# Altium schematic sheet 01_USB_Interface.SchDoc: Mainboard USB
size A3; SheetNumber: 1; SheetTotal: 3
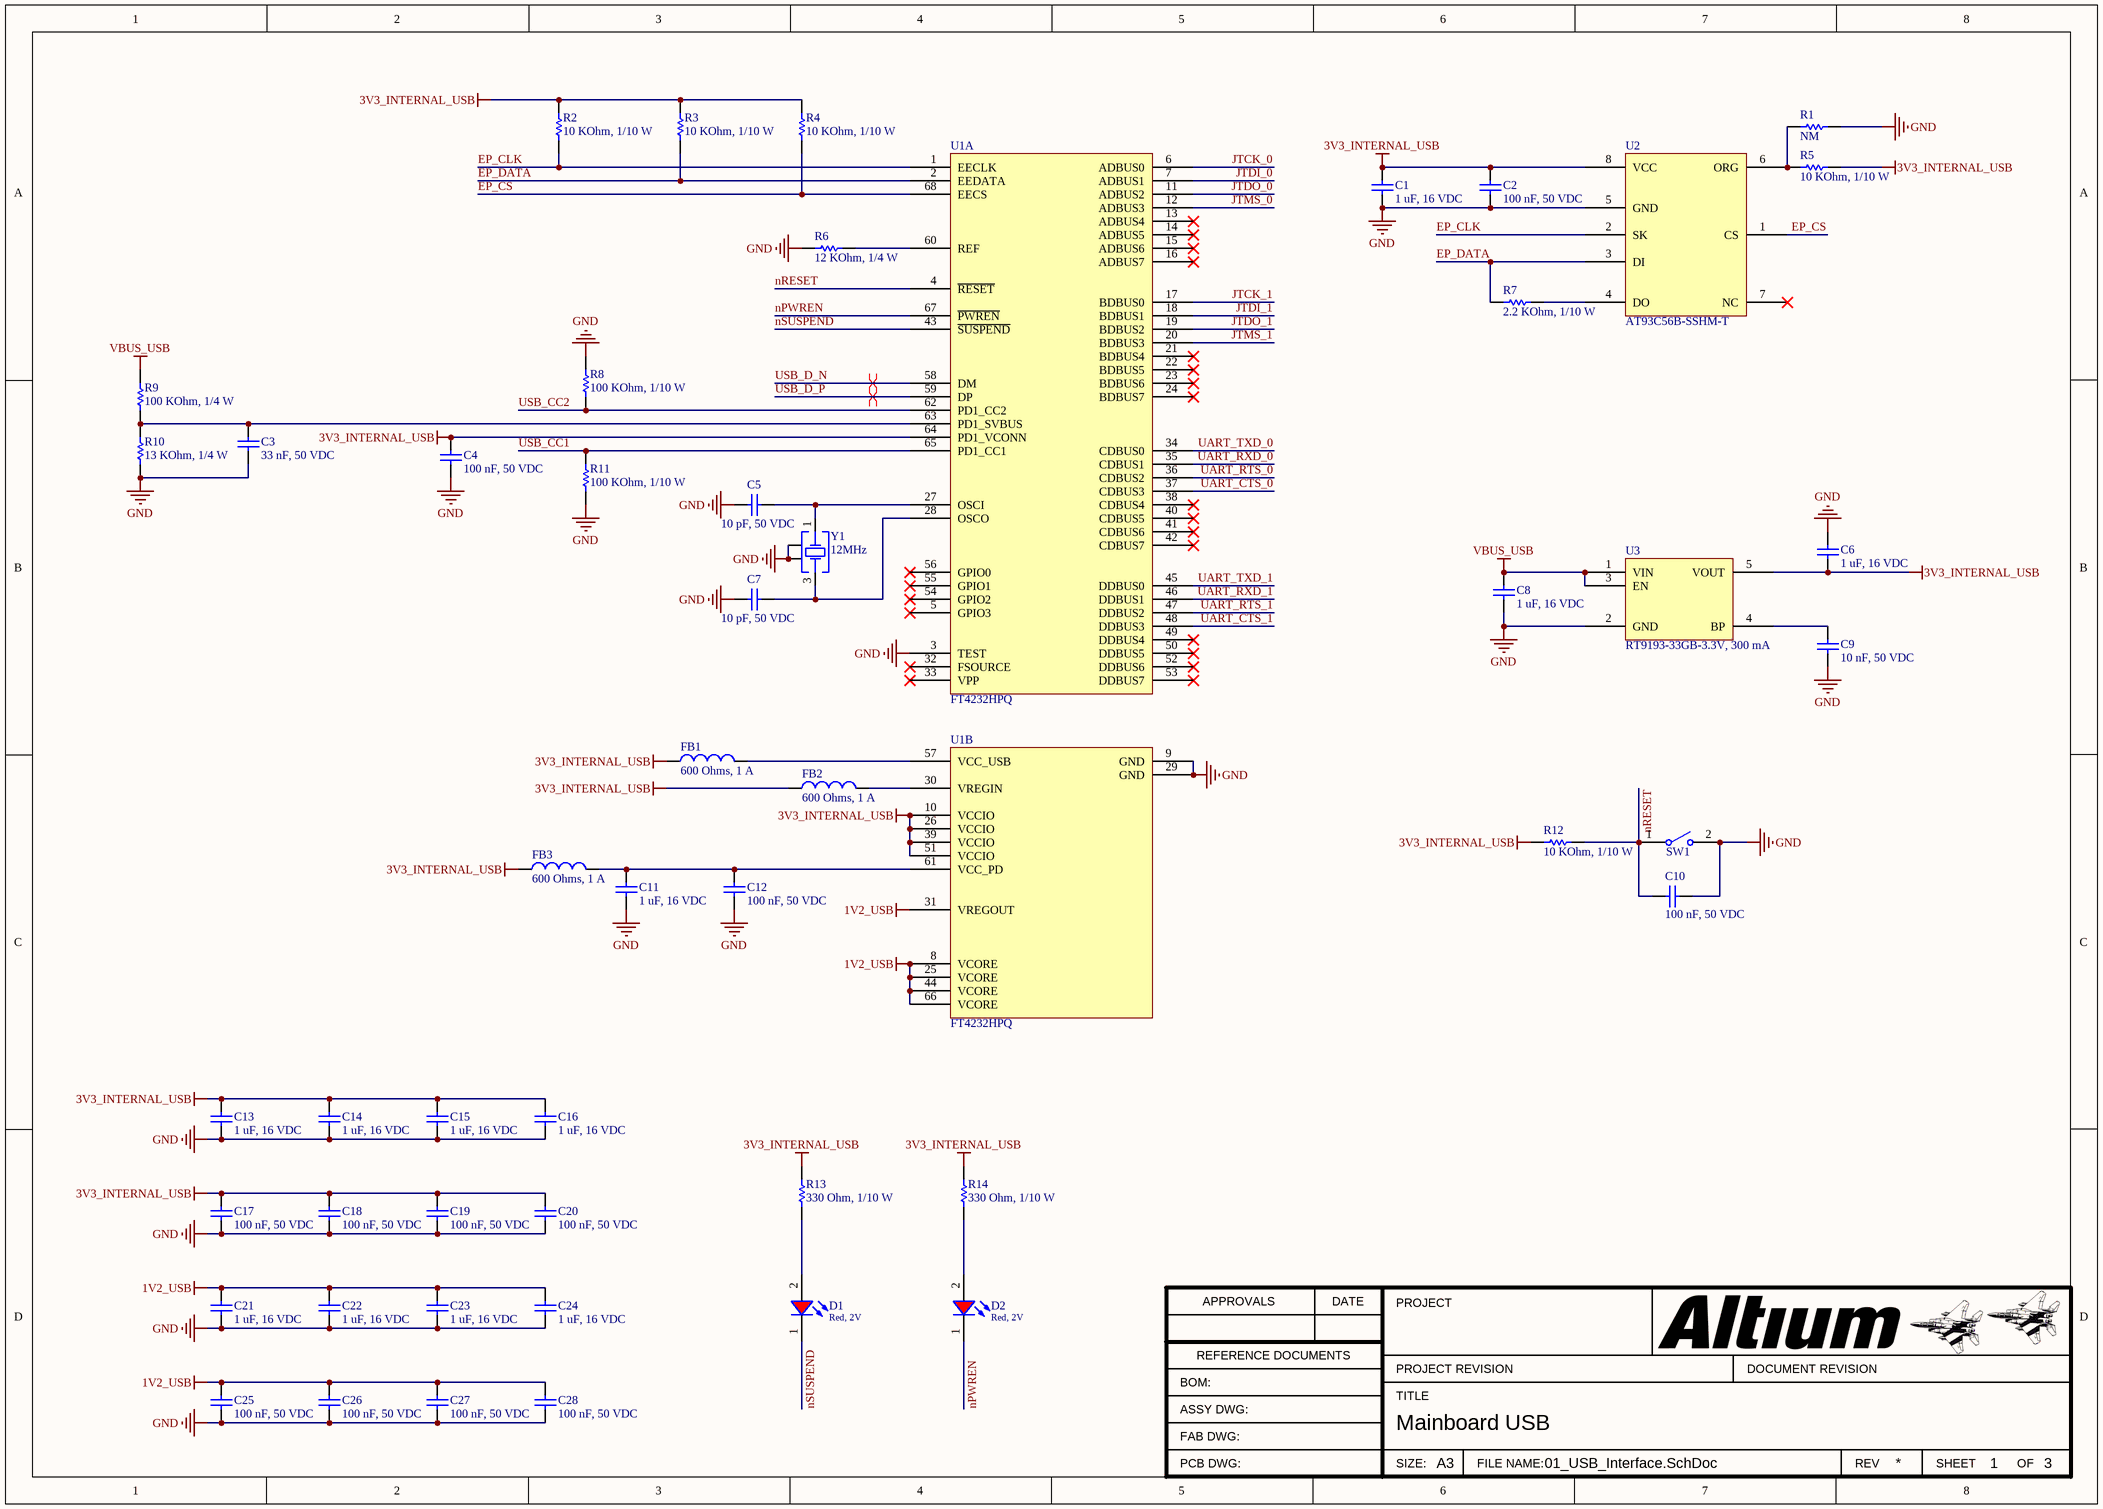
[diagram p0: 01_USB_Interface.SchDoc]

## Parts
C1  1 uF, 16 VDC  [CAP_0603]
C2  100 nF, 50 VDC  [CAP_0603]
C3  33 nF, 50 VDC  [CAP_0603]
C4  100 nF, 50 VDC  [CAP_0603]
C5  10 pF, 50 VDC  [CAP_0603]
C6  1 uF, 16 VDC  [CAP_0603]
C7  10 pF, 50 VDC  [CAP_0603]
C8  1 uF, 16 VDC  [CAP_0603]
C9  10 nF, 50 VDC  [CAP_0603]
C10  100 nF, 50 VDC  [CAP_0603]
C11  1 uF, 16 VDC  [CAP_0603]
C12  100 nF, 50 VDC  [CAP_0603]
C13  1 uF, 16 VDC  [CAP_0603]
C14  1 uF, 16 VDC  [CAP_0603]
C15  1 uF, 16 VDC  [CAP_0603]
C16  1 uF, 16 VDC  [CAP_0603]
C17  100 nF, 50 VDC  [CAP_0603]
C18  100 nF, 50 VDC  [CAP_0603]
C19  100 nF, 50 VDC  [CAP_0603]
C20  100 nF, 50 VDC  [CAP_0603]
C21  1 uF, 16 VDC  [CAP_0603]
C22  1 uF, 16 VDC  [CAP_0603]
C23  1 uF, 16 VDC  [CAP_0603]
C24  1 uF, 16 VDC  [CAP_0603]
C25  100 nF, 50 VDC  [CAP_0603]
C26  100 nF, 50 VDC  [CAP_0603]
C27  100 nF, 50 VDC  [CAP_0603]
C28  100 nF, 50 VDC  [CAP_0603]
D1  Red, 2V  [WL-SMCW_0603_H=0.7mm]
D2  Red, 2V  [WL-SMCW_0603_H=0.7mm]
FB1  600 Ohms, 1 A  [FER_0603]
FB2  600 Ohms, 1 A  [FER_0603]
FB3  600 Ohms, 1 A  [FER_0603]
R1  NM  [RES_0603]
R2  10 KOhm, 1/10 W  [RES_0603]
R3  10 KOhm, 1/10 W  [RES_0603]
R4  10 KOhm, 1/10 W  [RES_0603]
R5  10 KOhm, 1/10 W  [RES_0603]
R6  12 KOhm, 1/4 W  [RES_0603]
R7  2.2 KOhm, 1/10 W  [RES_0603]
R8  100 KOhm, 1/10 W  [RES_0603]
R9  100 KOhm, 1/4 W  [RES_0603]
R10  13 KOhm, 1/4 W  [RES_0603]
R11  100 KOhm, 1/10 W  [RES_0603]
R12  10 KOhm, 1/10 W  [RES_0603]
R13  330 Ohm, 1/10 W  [RES_0603]
R14  330 Ohm, 1/10 W  [RES_0603]
SW1  TS-1101-C-W  [TS-1101-C-W]  (value not drawn)
U1  FT4232HPQ  [FT4232HPQ]  (parts A,B of 2)
U2  AT93C56B-SSHM-T  [AT93C56B]
U3  RT9193-33GB-3.3V, 300 mA  [RT9193-xxGB]
Y1  12MHz  [WE-XTAL_CFPX-180]

## Nets
1V2_USB: C21.2 C22.2 C23.2 C24.2 C25.2 C26.2 C27.2 C28.2 U1.8(VCORE) U1.25(VCORE) U1.31(VREGOUT) U1.44(VCORE) U1.66(VCORE)
3V3_INTERNAL_USB: C1.2 C2.2 C4.2 C6.2 C13.2 C14.2 C15.2 C16.2 C17.2 C18.2 C19.2 C20.2 FB1.1 FB2.1 FB3.1 R2.2 R3.2 R4.2 R5.2 R12.2 R13.2 R14.2 U1.10(VCCIO) U1.26(VCCIO) U1.39(VCCIO) U1.51(VCCIO) U1.64(PD1_VCONN) U2.8(VCC) U3.5(VOUT)
GND: C1.1 C2.1 C3.1 C4.1 C5.1 C6.1 C7.1 C8.1 C9.1 C10.1 C11.1 C12.1 C13.1 C14.1 C15.1 C16.1 C17.1 C18.1 C19.1 C20.1 C21.1 C22.1 C23.1 C24.1 C25.1 C26.1 C27.1 C28.1 R1.1 R6.1 R8.1 R10.1 R11.1 SW1.2 U1.3(TEST) U1.9(GND) U1.29(GND) U2.5(GND) U3.2(GND) Y1.2(GND) Y1.4(GND)
VBUS_USB: C8.2 R9.2 U3.1(VIN) U3.3(EN)
EP_CLK: R2.1 U1.1(EECLK) U2.2(SK)
EP_CS: R4.1 U1.68(EECS) U2.1(CS)
EP_DATA: R3.1 R7.1 U1.2(EEDATA) U2.3(DI)
JTCK_0: U1.6(ADBUS0)
JTCK_1: U1.17(BDBUS0)
JTDI_0: U1.7(ADBUS1)
JTDI_1: U1.18(BDBUS1)
JTDO_0: U1.11(ADBUS2)
JTDO_1: U1.19(BDBUS2)
JTMS_0: U1.12(ADBUS3)
JTMS_1: U1.20(BDBUS3)
nPWREN: D2.1(K) U1.67(~{PWREN})
nRESET: C10.2 R12.1 SW1.1 U1.4(~{RESET})
nSUSPEND: D1.1(K) U1.43(~{SUSPEND})
UART_CTS_0: U1.37(CDBUS3)
UART_CTS_1: U1.48(DDBUS3)
UART_RTS_0: U1.36(CDBUS2)
UART_RTS_1: U1.47(DDBUS2)
UART_RXD_0: U1.35(CDBUS1)
UART_RXD_1: U1.46(DDBUS1)
UART_TXD_0: U1.34(CDBUS0)
UART_TXD_1: U1.45(DDBUS0)
USB_CC1: R11.2 U1.65(PD1_CC1)
USB_CC2: R8.2 U1.62(PD1_CC2)
USB_D_N: U1.58(DM)
USB_D_P: U1.59(DP)
NetC3_2: C3.2 R9.1 R10.2 U1.63(PD1_SVBUS)
NetC5_2: C5.2 U1.27(OSCI) Y1.1(Crystal)
NetC7_2: C7.2 U1.28(OSCO) Y1.3(Crystal)
NetC9_2: C9.2 U3.4(BP)
NetC11_2: C11.2 C12.2 FB3.2 U1.61(VCC_PD)
NetD1_2: D1.2(A) R13.1
NetD2_2: D2.2(A) R14.1
NetFB1_2: FB1.2 U1.57(VCC_USB)
NetFB2_2: FB2.2 U1.30(VREGIN)
NetR1_2: R1.2 R5.1 U2.6(ORG)
NetR6_2: R6.2 U1.60(REF)
NetR7_2: R7.2 U2.4(DO)

Not connected (* = marked no-connect by the designer): U1 5(GPIO3)* 13(ADBUS4)* 14(ADBUS5)* 15(ADBUS6)* 16(ADBUS7)* 21(BDBUS4)* 22(BDBUS5)* 23(BDBUS6)* 24(BDBUS7)* 32(FSOURCE)* 33(VPP)* 38(CDBUS4)* 40(CDBUS5)* 41(CDBUS6)* 42(CDBUS7)* 49(DDBUS4)* 50(DDBUS5)* 52(DDBUS6)* 53(DDBUS7)* 54(GPIO2)* 55(GPIO1)* 56(GPIO0)*; U2 7(NC)*

## Layout directives
differential pair: USB_D_N, USB_D_P

## Notes on the sheet
- APPROVALS
- DATE
- PROJECT
- BOM:
- REFERENCE DOCUMENTS
- TITLE
- PROJECT REVISION
- DOCUMENT REVISION
- ASSY DWG:
- FAB DWG:
- PCB DWG:
- SIZE:
- A3
- FILE NAME:
- REV
- SHEET
- OF

## Library data of the parts
C1 C6 C8 C11 C13-C16 C21-C24 = 0106031051016: CAP, size 0603, 1 uF, 16 VDC; Manufacturer: Samsung Electro-Mechanics; Manufacturer Part Number: CL10B105KO8NNWC; Capacitance: 1 uF; Tolerance: +/-10%; Voltage Rating DC: 16 VDC; Packaging: Tape and Reel; Supplier 1 URL: https://www.mouser.vn/ProductDetail/Samsung-Electro-Mechanics/CL10B105KO8NNWC?qs=81r%252BiQLm7BT%252BXtc72qn1ug%3D%3D&utm_source=mouser-refine-download&utm_medium=file&utm_campaign=CL10B105KO8NNWC&utm_content=Samsung-Electro-Mechanics; Supplier 2 URL: https://www.digikey.com/en/products/detail/samsung-electro-mechanics/cl10b105ko8nnwc/16572783; Supplier 3 URL: https://www.thegioiic.com/tu-gom-0603-1uf-16v; Value: 1 uF, 16 VDC; Supplier 1: Mouser; Supplier 1 Part Number: 187-CL10B105KO8NNWC; Supplier 2: Digi-Key; Supplier 2 Part Number: 1276-CL10B105KO8NNWCTR-ND; Supplier 3: thegioiic; Supplier 3 Part Number: N/A; ComponentLink1Description: Datasheet; ComponentLink1URL: https://www.mouser.vn/datasheet/2/585/Samsung_MLCC_1837944-1929650.pdf; Mount: SMD/SMT; Operating Temperature Max: + 85 C; Operating Temperature Min: - 40 C; Package / Case: 0603; LCSC Part #: C1592
C2 C4 C10 C12 C17-C20 C25-C28 = 0106031041050: CAP, size 0603, 100 nF, 50 VDC; Manufacturer: TDK; Manufacturer Part Number: CGA3E3X8R1H104K080AE; Capacitance: 100 nF; Tolerance: +/-10%; Voltage Rating DC: 50 VDC; Packaging: Tape and Reel; Supplier 1 URL: https://www.mouser.com/ProductDetail/TDK/CGA3E3X8R1H104K080AE?qs=nQSIdc08i%252Bd8g3IRRgU2bw%3D%3D&utm_source=mouser-refine-download&utm_medium=file&utm_campaign=CGA3E3X8R1H104K080AE&utm_content=TDK; Supplier 2 URL: https://www.digikey.com/en/products/detail/tdk-corporation/cga3e3x8r1h104k080ae/5809262; Supplier 3 URL: N/A; Value: 100 nF, 50 VDC; Supplier 1: Mouser; Supplier 1 Part Number: 810-CGA3E3X8R1H104KA; Supplier 2: Digi-Key; Supplier 2 Part Number: 445-173697-2-ND; Supplier 3: thegioiic; Supplier 3 Part Number: N/A; ComponentLink1Description: Datasheet; ComponentLink1URL: https://product.tdk.com/system/files/dam/doc/product/capacitor/ceramic/mlcc/catalog/mlcc_automotive_soft_en.pdf?ref_disty=mouser; Mount: SMD/SMT; Operating Temperature Max: + 85 C; Operating Temperature Min: - 40 C; Package / Case: 0603; LCSC Part #: C14663
C3 = 0106033331050: CAP, size 0603, 33 nF, 50 VDC; Manufacturer: TDK; Manufacturer Part Number: CGA3E2X7R1H333K080AA; Capacitance: 33 nF; Tolerance: +/-10%; Voltage Rating DC: 50 VDC; Packaging: Tape and Reel; Supplier 1 URL: https://www.mouser.com/ProductDetail/TDK/CGA3E2X7R1H333K080AA?qs=NRhsANhppD8XLu6u%252B%2FdPcg%3D%3D&utm_source=mouser-refine-download&utm_medium=file&utm_campaign=CGA3E2X7R1H333K080AA&utm_content=TDK; Supplier 2 URL: https://www.digikey.com/en/products/detail/tdk-corporation/cga3e2x7r1h333k080aa/2672817; Supplier 3 URL: N/A; Value: 33 nF, 50 VDC; Supplier 1: Mouser; Supplier 1 Part Number: 810-CGA3E2X7R1H333K; Supplier 2: Digi-Key; Supplier 2 Part Number: 445-6924-2-ND; Supplier 3: thegioiic; Supplier 3 Part Number: N/A; ComponentLink1Description: Datasheet; ComponentLink1URL: https://product.tdk.com/system/files/dam/doc/product/capacitor/ceramic/mlcc/catalog/mlcc_automotive_general_en.pdf?ref_disty=mouser; Mount: SMD/SMT; Operating Temperature Max: + 85 C; Operating Temperature Min: - 40 C; Package / Case: 0603; LCSC Part #: N/A
C5 C7 = 0106031000550: CAP, size 0603, 10 pF, 50 VDC; Manufacturer: TDK; Manufacturer Part Number: CGA3E2NP01H100D080AA; Capacitance: 10 pF; Tolerance: +/-5%; Voltage Rating DC: 50 VDC; Packaging: Tape and Reel; Supplier 1 URL: https://www.mouser.com/ProductDetail/TDK/CGA3E2NP01H100D080AA?qs=xLDY6iXSiQYSDBjUp7bVxg%3D%3D&utm_source=mouser-refine-download&utm_medium=file&utm_campaign=CGA3E2NP01H100D080AA&utm_content=TDK; Supplier 2 URL: https://www.digikey.com/en/products/detail/tdk-corporation/cga3e2np01h100d080aa/3949623; Supplier 3 URL: N/A; Value: 10 pF, 50 VDC; Supplier 1: Mouser; Supplier 1 Part Number: 810-CGA3E2NP01H100DA; Supplier 2: Digi-Key; Supplier 2 Part Number: 445-12387-2-ND; Supplier 3: thegioiic; Supplier 3 Part Number: N/A; ComponentLink1Description: Datasheet; ComponentLink1URL: https://product.tdk.com/system/files/dam/doc/product/capacitor/ceramic/mlcc/catalog/mlcc_automotive_hightemp_en.pdf?ref_disty=mouser; Mount: SMD/SMT; Operating Temperature Max: + 85 C; Operating Temperature Min: - 40 C; Package / Case: 0603; LCSC Part #: C597129
C9 = 0106031030550: CAP, size 0603, 10 nF, 50 VDC; Manufacturer: TDK; Manufacturer Part Number: CGA3E2C0G1H103J080AE; Capacitance: 10 nF; Tolerance: +/-5%; Voltage Rating DC: 50 VDC; Packaging: Tape and Reel; Supplier 1 URL: https://www.mouser.com/ProductDetail/TDK/CGA3E2C0G1H103J080AE?qs=P1JMDcb91o6ZkMITrWTUZQ%3D%3D&utm_source=mouser-refine-download&utm_medium=file&utm_campaign=CGA3E2C0G1H103J080AE&utm_content=TDK; Supplier 2 URL: https://www.digikey.com/en/products/detail/tdk-corporation/cga3e2c0g1h103j080ae/11697946; Supplier 3 URL: N/A; Value: 10 nF, 50 VDC; Supplier 1: Mouser; Supplier 1 Part Number: 810-CGA3E2C0G1H103J8; Supplier 2: Digi-Key; Supplier 2 Part Number: 445-CGA3E2C0G1H103J080AETR-ND; Supplier 3: thegioiic; Supplier 3 Part Number: N/A; ComponentLink1Description: Datasheet; ComponentLink1URL: https://product.tdk.com/system/files/dam/doc/product/capacitor/ceramic/mlcc/catalog/mlcc_automotive_soft_en.pdf?ref_disty=mouser; Mount: SMD/SMT; Operating Temperature Max: + 85 C; Operating Temperature Min: - 40 C; Package / Case: 0603
D1 D2 = 160603RedBlur: WL-SMCW SMT Mono-color Chip LED Blur, size 0603, Red, 2V, 140deg; Manufacturer: ROHM Semiconductor; Manufacturer Part Number: CSL1901VW1; Color: Red; Type: Blur; ComponentLink1Description: Datasheet; ComponentLink1URL: https://www.rohm.com/datasheet?p=CSL1901VW&dist=Mouser&media=referral&source=mouser.com&campaign=Mouser; Supplier 1 URL: https://www.mouser.vn/ProductDetail/ROHM-Semiconductor/CSL1901VW1?qs=vvQtp7zwQdNmrXZcE27xEA%3D%3D; Supplier 2 URL: https://www.digikey.com/en/products/detail/rohm-semiconductor/SML-D12U8WT86/1641799; Supplier 3 URL: N/A; Value: Red, 2V; Mount: SMD/SMT; Operating Temperature Max: + 85 C; Operating Temperature Min: - 40 C; Package / Case: 0603; Packaging: Tape and Reel; Supplier 1: Mouser; Supplier 1 Part Number: 755-CSL1901VW1; Supplier 2: Digi-Key; Supplier 2 Part Number: 511-1580-2-ND; Supplier 3: thegioiic; Supplier 3 Part Number: N/A; LCSC Part #: C510294
FB1-FB3 = 03060360110225: Ferrite, 0603, 600 Ohms, 1 A; Manufacturer: Wurth Elektronik; Manufacturer Part Number: 742792651; Tolerance: +/-25%; Maximum DC Current: 1 A; Maximum DC Resistance: 200 mOhms; Test Frequency: 100 MHz; Packaging: Tape and Reel; Supplier 1 URL: https://www.mouser.com/ProductDetail/Wurth-Elektronik/742792651?qs=sGAEpiMZZMt1hubY80%2Fs8M60rIzA20dgTaAssd1%2FEf4%3D&utm_source=mouser-refine-download&utm_medium=file&utm_campaign=742792651&utm_content=Wurth-Elektronik; Supplier 2 URL: N/A; Supplier 3 URL: N/A; Impedance: 600 Ohms; Value: 600 Ohms, 1 A; ComponentLink1Description: Datasheet; ComponentLink1URL: https://www.we-online.com/catalog/datasheet/742792651.pdf; Mount: SMD/SMT; Operating Temperature Max: 105°C; Operating Temperature Min: -55°C; Supplier 1: Mouser; Supplier 1 Part Number: 710-742792651; Supplier 2: Digi-Key; Supplier 2 Part Number: N/A; Supplier 3: thegioiic; Supplier 3 Part Number: N/A; Package / Case: 0603
R1 = 000603_NM: RES, size 0603, NM, N/A; Resistance: NM; Rated Power: N/A; Supplier 1 URL: N/A; Supplier 3 URL: N/A; Value: NM; Supplier 2 URL: N/A; Packaging: Tape and Reel; Supplier 1: Mouser; Supplier 1 Part Number: N/A; Supplier 2: Digi-Key; Supplier 2 Part Number: N/A; Supplier 3: thegioiic; Supplier 3 Part Number: N/A; Tolerance: N/A; Manufacturer: N/A; Manufacturer Part Number: N/A; ComponentLink1Description: Datasheet; ComponentLink1URL: N/A; Mount: SMD/SMT; Operating Temperature Max: + 85 C; Operating Temperature Min: - 40 C; Package / Case: 0603; LCSC Part #: N/A
R2-R5 R12 = 0006031031: RES, size 0603, 10 KOhm, 1/10 W, 1%; Manufacturer: YAGEO; Manufacturer Part Number: RC0603FR-0710KL; Resistance: 10 KOhm; Rated Power: 1/10 W; Tolerance: +/-1%; Supplier 1 URL: N/A; Supplier 3 URL: N/A; Value: 10 KOhm, 1/10 W; Supplier 2 URL: https://www.digikey.com/en/products/detail/yageo/rc0603fr-0710kl/726880; Packaging: Tape and Reel; Supplier 1: Mouser; Supplier 1 Part Number: N/A; Supplier 2: Digi-Key; Supplier 2 Part Number: 311-10.0KHRTR-ND; Supplier 3: thegioiic; Supplier 3 Part Number: N/A; ComponentLink1Description: Datasheet; ComponentLink1URL: https://fscdn.rohm.com/en/products/databook/datasheet/passive/resistor/chip_resistor/esr-e.pdf; Mount: SMD/SMT; Operating Temperature Max: + 85 C; Operating Temperature Min: - 40 C; Package / Case: 0603; LCSC Part #: C98220
R6 = 0006031231: RES, size 0603, 12 KOhm, 1/4 W; Manufacturer: OEM; Resistance: 12 KOhm; Rated Power: 1/4 W; Tolerance: +/-1%; Supplier 1 URL: https://www.mouser.vn/ProductDetail/Vishay-Dale/RCS060312K0FKEA?qs=sGAEpiMZZMvdGkrng054t9clqp6gtJJdYU2CGrvXFnAdCOf%2F3daJvA%3D%3D; Supplier 3 URL: N/A; Value: 12 KOhm, 1/4 W; ComponentLink1Description: Datasheet; ComponentLink1URL: https://www.vishay.com/doc?20065; Supplier 2 URL: https://www.digikey.com/en/products/detail/vishay-dale/RCS060312K0FKEA/5868600; Packaging: Tape and Reel; Supplier 1: Mouser; Supplier 1 Part Number: 71-RCS060312K0FKEA; Supplier 2: Digi-Key; Supplier 2 Part Number: 541-10428-2-ND 541-10428-1-ND 541-10428-6-ND; Supplier 3: thegioiic; Supplier 3 Part Number: N/A; Manufacturer Part Number: OEM; Mount: SMD/SMT; Operating Temperature Max: + 85 C; Operating Temperature Min: - 40 C; Package / Case: 0603; LCSC Part #: N/A
R7 = 0006032221: RES, size 0603, 2.2  KOhm, 1/10 W, 1%; Manufacturer: OEM; Rated Power: 1/10 W; Tolerance: +/-1%; Resistance: 2.2  KOhm; Supplier 1 URL: https://www.mouser.vn/ProductDetail/YAGEO/SR0603FR-7T2K2L?qs=pfd5qewlna6SQQIuviAJZA%3D%3D; Supplier 3 URL: N/A; Value: 2.2 KOhm, 1/10 W; Supplier 2 URL: https://www.digikey.com/en/products/detail/yageo/RC0603FR-132K2L/13694214; Packaging: Tape and Reel; Supplier 1: Mouser; Supplier 1 Part Number: 603-SR0603FR-7T2K2L; Supplier 2: Digi-Key; Supplier 2 Part Number: 13-RC0603FR-132K2LTR-ND; Supplier 3: thegioiic; Supplier 3 Part Number: N/A; Manufacturer Part Number: OEM; ComponentLink1Description: Datasheet; ComponentLink1URL: N/A; Mount: SMD/SMT; Operating Temperature Max: + 85 C; Operating Temperature Min: - 40 C; Package / Case: 0603; LCSC Part #: N/A
R8 R11 = 0006031041: RES, size 0603, 100 KOhm, 1/10 W, 1%; Manufacturer: OEM; Rated Power: 1/10 W; Tolerance: +/-1%; Resistance: 100 KOhm; Supplier 1 URL: https://www.mouser.vn/ProductDetail/YAGEO/SR0603FR-7T100KL?qs=sGAEpiMZZMvdGkrng054tz1y1XEHv7sNa%252BA%2F4WiDMf7aGw4zRBb%2FFQ%3D%3D; Supplier 3 URL: N/A; Value: 100 KOhm, 1/10 W; Supplier 2 URL: https://www.digikey.com/en/products/detail/yageo/SR0603FR-7T100KL/9373095; Packaging: Tape and Reel; Supplier 1: Mouser; Supplier 1 Part Number: 603-SR0603FR-7T100KL; Supplier 2: Digi-Key; Supplier 2 Part Number: YAG5821TR-ND YAG5821CT-ND YAG5821DKR-ND; Supplier 3: thegioiic; Supplier 3 Part Number: N/A; Manufacturer Part Number: OEM; ComponentLink1Description: Datasheet; ComponentLink1URL: https://www.yageo.com/upload/media/product/productsearch/datasheet/rchip/PYu-SR_20105_RoHS_L_10.pdf; Mount: SMD/SMT; Operating Temperature Max: + 85 C; Operating Temperature Min: - 40 C; Package / Case: 0603; LCSC Part #: N/A
R9 = 0006031041: RES, size 0603, 100 KOhm, 1/4 W; Manufacturer: OEM; Rated Power: 1/4 W; Tolerance: +/-1%; Resistance: 100 KOhm; Supplier 1 URL: https://www.mouser.vn/ProductDetail/YAGEO/SR0603FR-7T100KL?qs=sGAEpiMZZMvdGkrng054tz1y1XEHv7sNa%252BA%2F4WiDMf7aGw4zRBb%2FFQ%3D%3D; Supplier 3 URL: N/A; Value: 100 KOhm, 1/4 W; ComponentLink1Description: Datasheet; ComponentLink1URL: https://www.yageo.com/upload/media/product/productsearch/datasheet/rchip/PYu-SR_20105_RoHS_L_10.pdf; Supplier 2 URL: https://www.digikey.com/en/products/detail/yageo/SR0603FR-7T100KL/9373095; Packaging: Tape and Reel; Supplier 1: Mouser; Supplier 1 Part Number: 603-SR0603FR-7T100KL; Supplier 2: Digi-Key; Supplier 2 Part Number: YAG5821TR-ND YAG5821CT-ND YAG5821DKR-ND; Supplier 3: thegioiic; Supplier 3 Part Number: N/A; Manufacturer Part Number: OEM; Mount: SMD/SMT; Operating Temperature Max: + 85 C; Operating Temperature Min: - 40 C; Package / Case: 0603; LCSC Part #: N/A
R10 = 0006031331: RES, size 0603, 13 KOhm, 1/4 W; Manufacturer: OEM; Resistance: 13 KOhm; Rated Power: 1/4 W; Tolerance: +/-1%; Supplier 1 URL: https://www.mouser.vn/ProductDetail/ROHM-Semiconductor/ESR03EZPF1302?qs=sGAEpiMZZMvdGkrng054tywGjayRHxH2BixSkNTZUClpiy4%252BI%252BxkXA%3D%3D; Supplier 3 URL: N/A; Value: 13 KOhm, 1/4 W; ComponentLink1Description: Datasheet; ComponentLink1URL: https://fscdn.rohm.com/en/products/databook/datasheet/passive/resistor/chip_resistor/esr-e.pdf; Supplier 2 URL: https://www.digikey.com/en/products/detail/rohm-semiconductor/ESR03EZPF1302/4007159; Packaging: Tape and Reel; Supplier 1: Mouser; Supplier 1 Part Number: 755-ESR03EZPF1302; Supplier 2: Digi-Key; Supplier 2 Part Number: ESR03EZPF1302-ND; Supplier 3: thegioiic; Supplier 3 Part Number: N/A; Manufacturer Part Number: OEM; Mount: SMD/SMT; Operating Temperature Max: + 85 C; Operating Temperature Min: - 40 C; Package / Case: 0603; LCSC Part #: N/A
R13 R14 = 0006033311: RES, size 0603, 330 Ohm, 1/10 W; Manufacturer: OEM; Resistance: 330 Ohm; Rated Power: 1/10 W; Tolerance: +/-1%; Supplier 1 URL: https://www.mouser.vn/ProductDetail/Panasonic/ERJ-UP3F3300V?qs=sGAEpiMZZMvdGkrng054twq3eZrCFN89MDZusw5Tf7mZnfRSpxxqIA%3D%3D; Supplier 3 URL: N/A; Value: 330 Ohm, 1/10 W; ComponentLink1Description: Datasheet; ComponentLink1URL: https://api.pim.na.industrial.panasonic.com/file_stream/main/fileversion/4484; Supplier 2 URL: https://www.digikey.com/en/products/detail/panasonic-electronic-components/ERJ-UP3F3300V/12093106; Packaging: Tape and Reel; Supplier 1: Mouser; Supplier 1 Part Number: 667-ERJ-UP3F3300V; Supplier 2: Digi-Key; Supplier 2 Part Number: 10-ERJ-UP3F3300VTR-ND 10-ERJ-UP3F3300VCT-ND 10-ERJ-UP3F3300VDKR-ND; Supplier 3: thegioiic; Supplier 3 Part Number: N/A; Manufacturer Part Number: OEM; Mount: SMD/SMT; Operating Temperature Max: + 85 C; Operating Temperature Min: - 40 C; Package / Case: 0603; LCSC Part #: C105881
SW1 = TS-1101-C-W: Tact Switch, L6 x W3.8 x H2.5mm, 260g, SPST-NO, 12V, 50mA; Manufacturer: Wurth Elektronik; Match Code: WS-TASV; Washable: No; Rated Voltage: 12VDC; Manufacturer Part Number: TS-1101-C-W; Category: Tact Switches; Mount: Surface Mount; Operating Temperature Max: 85°C; Operating Temperature Min: -40°C; Packaging: Tape and Reel; Length: 6mm; Width: 3.6mm; Height: 2.5mm; Circuit: SPST-NO; Contact Material: Stainless Steel; Operation Force: 260g; Rated Current: 50mA; Terminal Material: Copper Alloy; Terminal Plating: Silver; Supplier 1 URL: N/A; Supplier 2 URL: N/A; Supplier 3 URL: https://www.thegioiic.com/nut-nhan-3-5x6mm-cao-2-5mm-2-chan-smd-dau-do; LCSC Part #: XKB Connectivity; ComponentLink1Description: Datasheet; ComponentLink1URL: https://www.we-online.com/redexpert/spec/434111025826?ad; Package / Case: 0805; Supplier 1: Mouser; Supplier 1 Part Number: N/A; Supplier 2: Digi-Key; Supplier 2 Part Number: N/A; Supplier 3: thegioiic; Supplier 3 Part Number: OEM; Value: TS-1101-C-W
U1 = FT4232HPQ: USB Interface IC USB Bridge Type-C 3.0 32-Bit 8kB 48kB; Manufacturer: FTDI; Data rate: 12 Mb/s; Numbers of Ports: 2 Port; Pad count: 68; Speed: High Speed (HS); Supply Voltage - Max: 1.08 V; Supply Voltage - Min: 1.32 V; Active: Active; Standard: USB-C 3.0; Supplier 1 URL: https://www.mouser.com/ProductDetail/FTDI/FT4232HPQ-TRAY?qs=DRkmTr78QATL4FSPfVZC7Q%3D%3D; Supplier 2 URL: https://www.digikey.com/en/products/detail/ftdi-future-technology-devices-international-ltd/ft4232hpq-tray/13981003; Supplier 3 URL: N/A; Value: FT4232HPQ; Manufacturer Part Number: FT4232HPQ; Packaging: Tape and Reel; Supplier 1: Mouser; Supplier 1 Part Number: 895-FT4232HPQ-TRAY; Supplier 2: Digi-Key; Supplier 2 Part Number: 768-FT4232HPQ-TRAY-ND; Supplier 3: thegioiic; Supplier 3 Part Number: N/A; Mount: SMD/SMT; Operating Temperature Max: + 85 C; Operating Temperature Min: - 40 C; Package / Case: QFN-68; ComponentLink1Description: Datasheet; ComponentLink1URL: https://www.mouser.com/datasheet/2/163/DS_FT4233HP-3135614.pdf; LCSC Part #: N/A
U2 = AT93C56B-SSHM-T: EEPROM 2K (256x8/128x16) 3-WIRE, NiPdAu, 1.7V; Manufacturer: Microchip; Interface Type: 3-Wire, Microwire; Maximum Clock Frequency: 2 MHz; Memory Size: 2 kbit; Supply Voltage - Max: 5.5 V; Supplier 1 URL: https://www.mouser.com/ProductDetail/Microchip-Technology/AT93C56B-SSHM-T?qs=SxVMCiT8IVF4cB2r9UHj%252Bg%3D%3D; Supplier 2 URL: N/A; Supplier 3 URL: https://www.thegioiic.com/at93c56-10si-ic-eeprom-2kbit-8-soic; Value: AT93C56B-SSHM-T; Manufacturer Part Number: AT93C56B-SSHM-T; Supplier 1: Mouser; Supplier 1 Part Number: 556-AT93C56B-SSHM-T; Supplier 2: Digi-Key; Supplier 2 Part Number: N/A; Supplier 3: thegioiic; Supplier 3 Part Number: AT93C56-10SI; Mount: SMD/SMT; Operating Temperature Max: + 85 C; Operating Temperature Min: - 40 C; Package / Case: SOIC-8 Narrow; Packaging: Tape and Reel; Supply Voltage - Min: 1.7 V; ComponentLink1Description: Datasheet; ComponentLink1URL: https://www.mouser.com/datasheet/2/268/Atmel_8735_SEEPROM_AT93C56B_66B_Datasheet-1368838.pdf; LCSC Part #: C111441
U3 = RT9193-33GB: LDO Voltage Regulators 300mA, Ultra-Low Noise, Ultra-Fast CMOS LDO Regulator, SOT-23-5,  3.3 V; Manufacturer: Richtek; Voltage Output: 3.3V; Rated Current: 90 uA; Voltage Input Minimum: 2.5V; PSRR: - 70 dB; Voltage Drop: 220 mV; Voltage Input Maximum: 5.5V; Packaging: Tape and Reel; Current Output: 300 mA; Product: LDO Voltage Regulators; Supplier 1 URL: https://www.mouser.vn/ProductDetail/Richtek/RT9193-33GB?qs=amGC7iS6iy8ybRcZ9Wn2ww%3D%3D; Supplier 2 URL: https://www.digikey.com/en/products/detail/richtek-usa-inc/RT9193-33GB/2470048?s=N4IgTCBcDaIEoBUCcBGJBmAtO9BxAQiALoC%2BQA; Supplier 3 URL: N/A; Value: RT9193-33GB-3.3V, 300 mA; Manufacturer Part Number: RT9193-33GB; Mount: SMD/SMT; Operating Temperature Max: + 85 C; Operating Temperature Min: - 40 C; Package / Case: SOT-23-5; Supplier 1: Mouser; Supplier 1 Part Number: 835-RT9193-33GB; Supplier 2: Digi-Key; Supplier 2 Part Number: 1028-1014-6-ND; Supplier 3: thegioiic; Supplier 3 Part Number: N/A; ComponentLink1Description: Datasheet; ComponentLink1URL: https://www.mouser.vn/datasheet/2/1458/DS9193_18-3104722.pdf; LCSC Part #: C15651
Y1 = 073525126010: WE-XTAL Quartz Crystal, SMT, CFPX-180, 12MHz, +/-30ppm; Manufacturer Part Number: NX3225SA-12MHZ-STD-CSR-6; Manufacturer: NDK; Frequency Stability: +/-25ppm; Load Capacitance: 8pF; Frequency Tolerance: +/-15ppm; Frequency: 12MHz; Mounting Technology: SMT; Supplier 3 URL: https://www.thegioiic.com/thach-anh-12mhz-5032-4-chan-smd; ComponentLink1Description: Datasheet; ComponentLink1URL: https://www.mouser.com/datasheet/2/905/c_NX3225SA_e-1317523.pdf; Supplier 1 URL: https://www.mouser.com/ProductDetail/NDK/NX3225SA-12MHZ-STD-CSR-6?qs=55YtniHzbhCh3aOy4zgUJQ%3D%3D; Supplier 2 URL: https://www.digikey.com/en/products/detail/ndk-america-inc/NX3225SA-12MHZ-STD-CSR-6/3125639; Value: 12MHz; Operating Temperature Max: + 70 C; Operating Temperature Min: + 20 C; Package / Case: CFPX-104/5032; Packaging: Tape and Reel; Supplier 1: Mouser; Supplier 1 Part Number: 344-NX3225SA12MCSR6; Supplier 2: Digi-Key; Supplier 2 Part Number: 644-1180-2-ND; Supplier 3: thegioiic; Supplier 3 Part Number: N/A; LCSC Part #: N/A